# EAGLE schematic Kick_mess_01 (EAGLE 9.6.2)
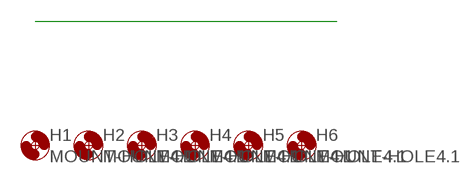
[diagram p0: schematic, sheet 1]

## Parts
H1  MOUNT-HOLE4.1  [4,1]
H2  MOUNT-HOLE4.1  [4,1]
H3  MOUNT-HOLE4.1  [4,1]
H4  MOUNT-HOLE4.1  [4,1]
H5  MOUNT-HOLE4.1  [4,1]
H6  MOUNT-HOLE4.1  [4,1]

## Library data of the parts
H1-H6 = holes:MOUNT-HOLE: MOUNTING HOLE with drill center marker